# Altium schematic sheet M1 Design.SchDoc
size A3; SheetNumber: 1; SheetTotal: 1
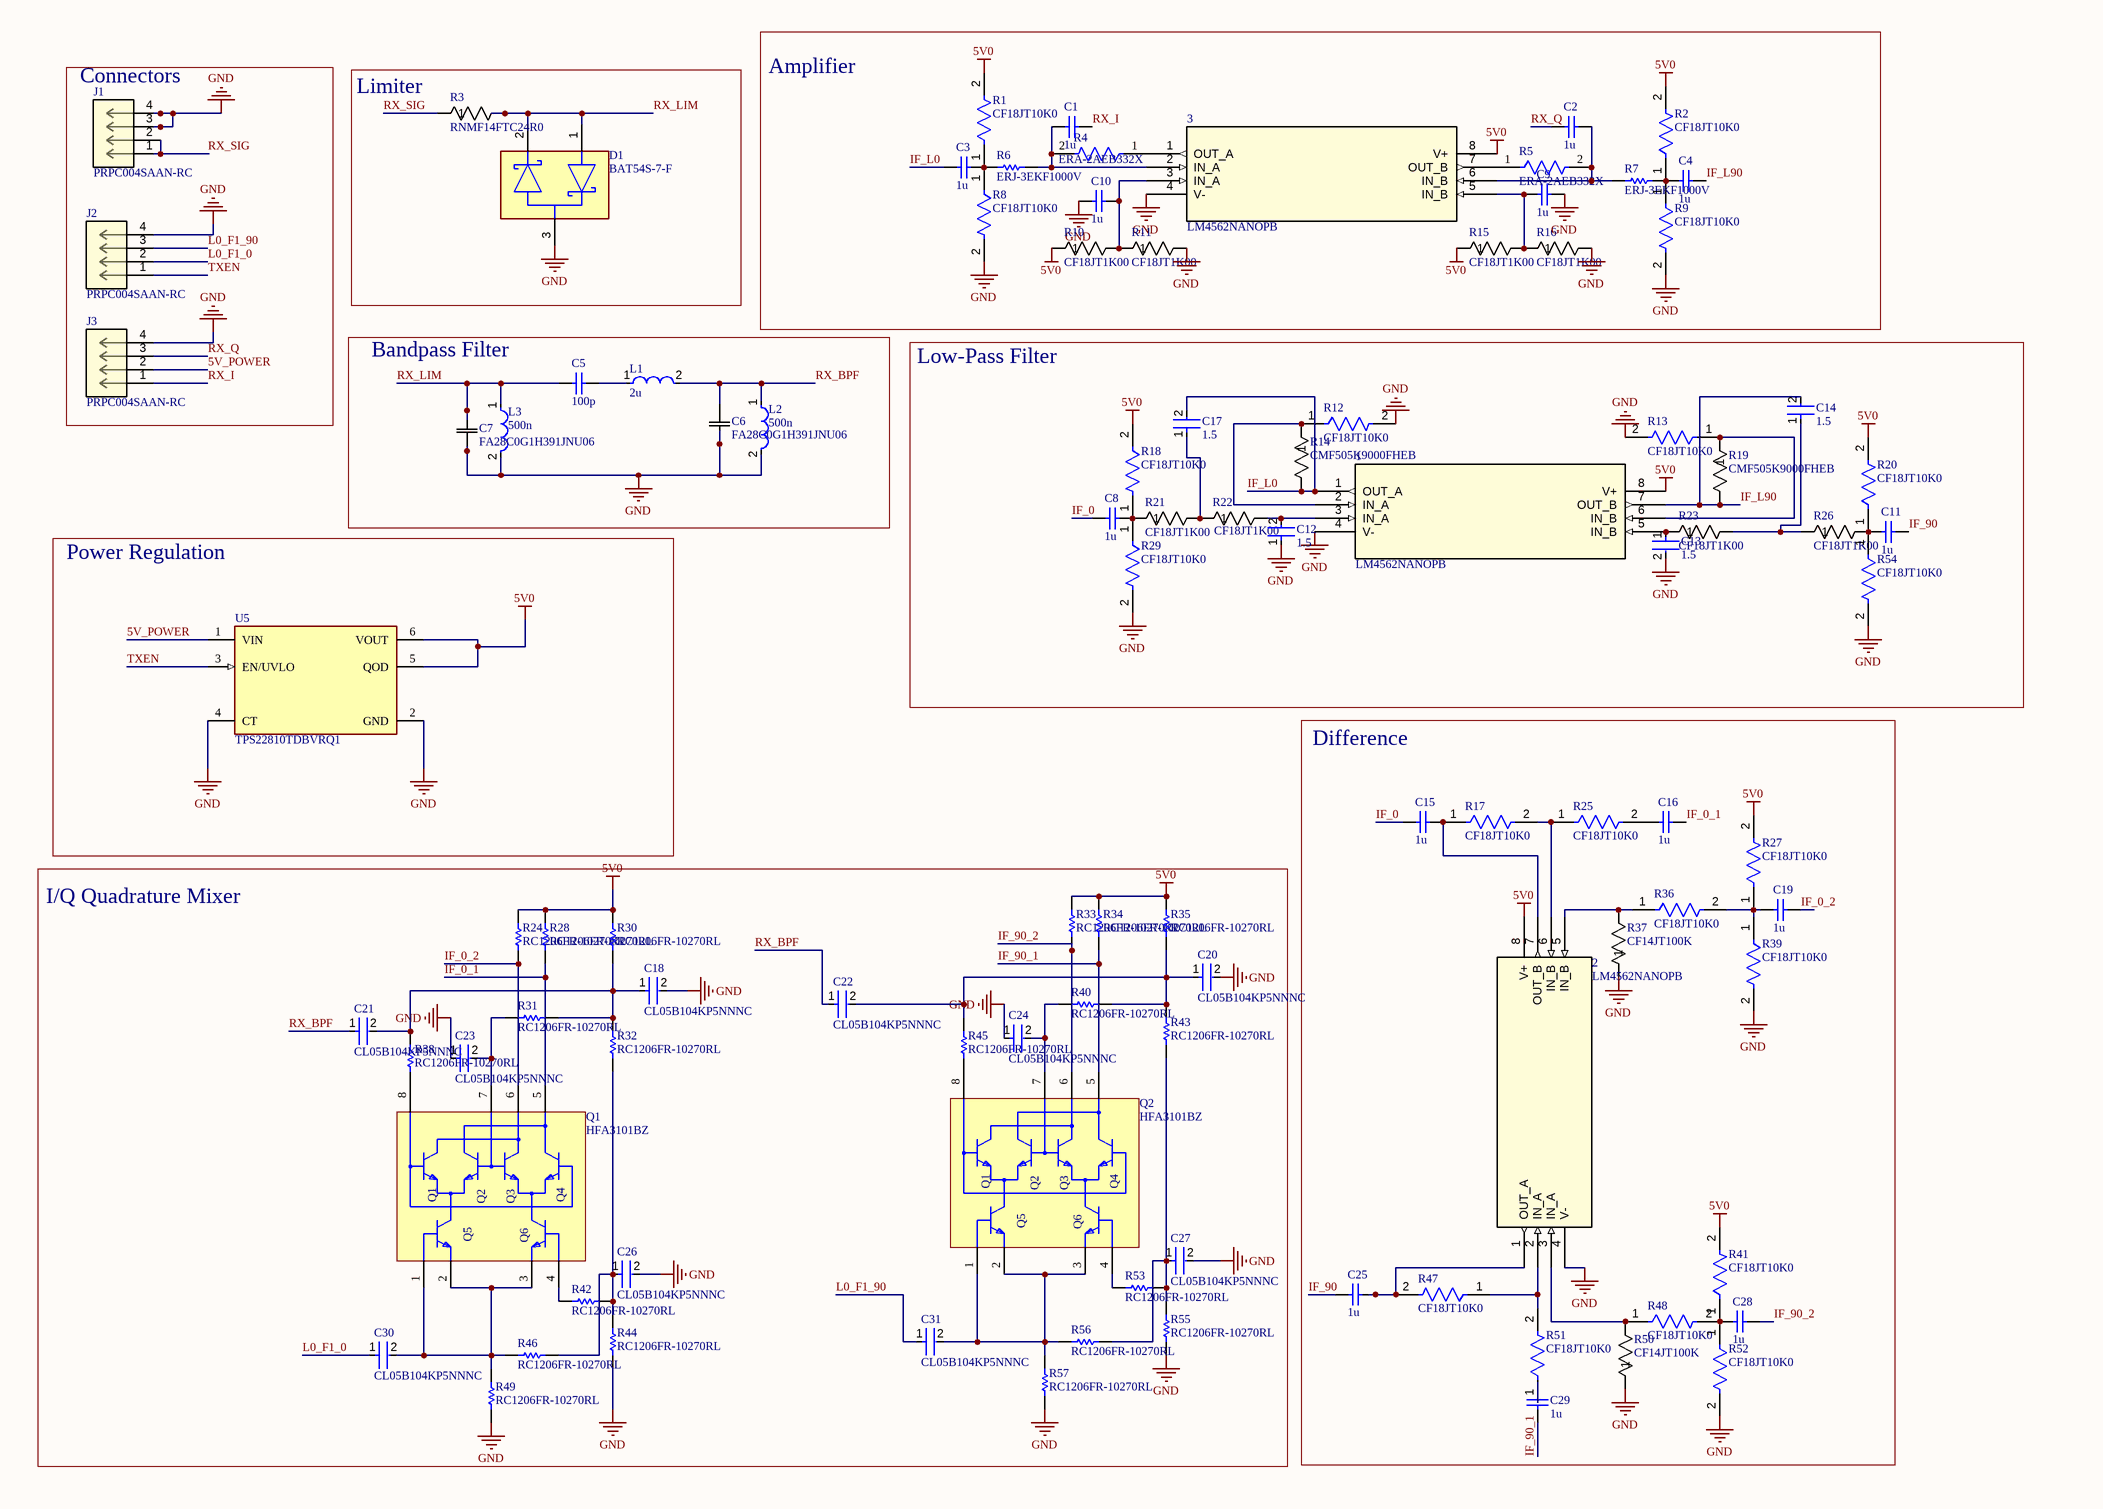
[diagram p0: M1 Design.SchDoc]

## Parts
1  LM4562NANOPB  [N08E]
2  LM4562NANOPB  [N08E]
3  LM4562NANOPB  [N08E]
C1  1u  [CAPC3216X110X50LL20T25]
C2  1u  [CAPC3216X110X50LL20T25]
C3  1u  [CAPC3216X110X50LL20T25]
C4  1u  [CAPC3216X110X50LL20T25]
C5  100p  [CAPC1608X90X40ML10T20]
C6  FA28C0G1H391JNU06  [CAP_FA28_TDK]
C7  FA28C0G1H391JNU06  [CAP_FA28_TDK]
C8  1u  [CAPC3216X110X50LL20T25]
C9  1u  [CAPC3216X110X50LL20T25]
C10  1u  [CAPC3216X110X50LL20T25]
C11  1u  [CAPC3216X110X50LL20T25]
C12  1.5  [FP-C0402-BB-MFG]
C13  1.5  [FP-C0402-BB-MFG]
C14  1.5  [FP-C0402-BB-MFG]
C15  1u  [CAPC3216X110X50LL20T25]
C16  1u  [CAPC3216X110X50LL20T25]
C17  1.5  [FP-C0402-BB-MFG]
C18  CL05B104KP5NNNC  [FP-CL17-IPC_C]
C19  1u  [CAPC3216X110X50LL20T25]
C20  CL05B104KP5NNNC  [FP-CL17-IPC_C]
C21  CL05B104KP5NNNC  [FP-CL17-IPC_C]
C22  CL05B104KP5NNNC  [FP-CL17-IPC_C]
C23  CL05B104KP5NNNC  [FP-CL17-IPC_C]
C24  CL05B104KP5NNNC  [FP-CL17-IPC_C]
C25  1u  [CAPC3216X110X50LL20T25]
C26  CL05B104KP5NNNC  [FP-CL17-IPC_C]
C27  CL05B104KP5NNNC  [FP-CL17-IPC_C]
C28  1u  [CAPC3216X110X50LL20T25]
C29  1u  [CAPC3216X110X50LL20T25]
C30  CL05B104KP5NNNC  [FP-CL17-IPC_C]
C31  CL05B104KP5NNNC  [FP-CL17-IPC_C]
D1  BAT54S-7-F  [FP-SOT23-MFG]
J1  PRPC004SAAN-RC  [CONN4_PRPC004_SUL]
J2  PRPC004SAAN-RC  [CONN4_PRPC004_SUL]
J3  PRPC004SAAN-RC  [CONN4_PRPC004_SUL]
L1  2u  [FP-LQW15CA_00-MFG]
L2  500n  [FP-LQW15CA_00-MFG]
L3  500n  [FP-LQW15CA_00-MFG]
Q1  HFA3101BZ  [M8_15_MFG]
Q2  HFA3101BZ  [M8_15_MFG]
R1  CF18JT10K0  [FP-CF18-MFG]
R2  CF18JT10K0  [FP-CF18-MFG]
R3  RNMF14FTC24R0  [STA_RNMF14_STP]
R4  ERA-2AEB332X  [FP-ERA2A-MFG]
R5  ERA-2AEB332X  [FP-ERA2A-MFG]
R6  ERJ-3EKF1000V  [RESC1608X55X30LL15T15]
R7  ERJ-3EKF1000V  [RESC1608X55X30LL15T15]
R8  CF18JT10K0  [FP-CF18-MFG]
R9  CF18JT10K0  [FP-CF18-MFG]
R10  CF18JT1K00  [STA_CF18_STP]
R11  CF18JT1K00  [STA_CF18_STP]
R12  CF18JT10K0  [FP-CF18-MFG]
R13  CF18JT10K0  [FP-CF18-MFG]
R14  CMF505K9000FHEB  [RES_CMF50_VIS]
R15  CF18JT1K00  [STA_CF18_STP]
R16  CF18JT1K00  [STA_CF18_STP]
R17  CF18JT10K0  [FP-CF18-MFG]
R18  CF18JT10K0  [FP-CF18-MFG]
R19  CMF505K9000FHEB  [RES_CMF50_VIS]
R20  CF18JT10K0  [FP-CF18-MFG]
R21  CF18JT1K00  [STA_CF18_STP]
R22  CF18JT1K00  [STA_CF18_STP]
R23  CF18JT1K00  [STA_CF18_STP]
R24  RC1206FR-10270RL  [RESC3116X65X40NL10T20]
R25  CF18JT10K0  [FP-CF18-MFG]
R26  CF18JT1K00  [STA_CF18_STP]
R27  CF18JT10K0  [FP-CF18-MFG]
R28  RC1206FR-10270RL  [RESC3116X65X40NL10T20]
R29  CF18JT10K0  [FP-CF18-MFG]
R30  RC1206FR-10270RL  [RESC3116X65X40NL10T20]
R31  RC1206FR-10270RL  [RESC3116X65X40NL10T20]
R32  RC1206FR-10270RL  [RESC3116X65X40NL10T20]
R33  RC1206FR-10270RL  [RESC3116X65X40NL10T20]
R34  RC1206FR-10270RL  [RESC3116X65X40NL10T20]
R35  RC1206FR-10270RL  [RESC3116X65X40NL10T20]
R36  CF18JT10K0  [FP-CF18-MFG]
R37  CF14JT100K  [STA_CF14_STP]
R38  RC1206FR-10270RL  [RESC3116X65X40NL10T20]
R39  CF18JT10K0  [FP-CF18-MFG]
R40  RC1206FR-10270RL  [RESC3116X65X40NL10T20]
R41  CF18JT10K0  [FP-CF18-MFG]
R42  RC1206FR-10270RL  [RESC3116X65X40NL10T20]
R43  RC1206FR-10270RL  [RESC3116X65X40NL10T20]
R44  RC1206FR-10270RL  [RESC3116X65X40NL10T20]
R45  RC1206FR-10270RL  [RESC3116X65X40NL10T20]
R46  RC1206FR-10270RL  [RESC3116X65X40NL10T20]
R47  CF18JT10K0  [FP-CF18-MFG]
R48  CF18JT10K0  [FP-CF18-MFG]
R49  RC1206FR-10270RL  [RESC3116X65X40NL10T20]
R50  CF14JT100K  [STA_CF14_STP]
R51  CF18JT10K0  [FP-CF18-MFG]
R52  CF18JT10K0  [FP-CF18-MFG]
R53  RC1206FR-10270RL  [RESC3116X65X40NL10T20]
R54  CF18JT10K0  [FP-CF18-MFG]
R55  RC1206FR-10270RL  [RESC3116X65X40NL10T20]
R56  RC1206FR-10270RL  [RESC3116X65X40NL10T20]
R57  RC1206FR-10270RL  [RESC3116X65X40NL10T20]
U5  TPS22810TDBVRQ1  [FP-DBV0006A-MFG]

## Blocks framed on the sheet
Connectors: J1-J3
Limiter: D1 R3
Amplifier: 3 C1-C4 C9 C10 R1 R2 R4-R11 R15 R16
Bandpass Filter: C5-C7 L1-L3
Low-Pass Filter: 1 C8 C11-C14 C17 R12-R14 R18-R23 R26 R29 R54
Power Regulation: U5
Difference: 2 C15 C16 C19 C25 C28 C29 R17 R25 R27 R36 R37 R39 R41 R47 R48 R50-R52
I/Q Quadrature Mixer: C18 C20-C24 C26 C27 C30 C31 Q1 Q2 R24 R28 R30-R35 R38 R40 R42-R46 R49 R53 R55-R57

## Nets
5V0: 1.8(V+) 2.8(V+) 3.8(V+) R1.2 R2.2 R10.1 R15.1 R18.2 R20.2 R24.2 R27.2 R28.2 R30.2 R33.2 R34.2 R35.2 R41.2 U5.5(QOD) U5.6(VOUT)
GND: 1.4(V-) 2.4(V-) 3.4(V-) C6.1 C7.1 C9.2 C10.1 C12.1 C13.2 C18.2 C20.2 C23.1 C24.1 C26.2 C27.2 D1.3 J1.3 J1.4 J2.4 J3.4 L2.2 L3.2 R8.2 R9.2 R11.2 R12.2 R13.2 R16.2 R29.2 R37.1 R39.2 R44.1 R49.1 R50.1 R52.2 R54.2 R55.1 R57.1 U5.2(GND) U5.4(CT)
5V_POWER: J3.2 U5.1(VIN)
IF_0: C8.1 C15.1
IF_0_1: C16.2 Q1.5(C2_C4) R28.1
IF_0_2: C19.2 Q1.6(C1_C3) R24.1
IF_90: C11.2 C25.1
IF_90_1: C29.2 Q2.5(C2_C4) R34.1
IF_90_2: C28.2 Q2.6(C1_C3) R33.1
IF_L0: 1.1(OUT_A) C3.1 C17.2 R14.2
IF_L90: 1.7(OUT_B) C4.2 C14.2 R19.2
L0_F1_0: C30.1 J2.2
L0_F1_90: C31.1 J2.3
RX_BPF: C6.2 C21.1 C22.1 L1.2 L2.1
RX_I: C1.2 J3.1
RX_LIM: C5.1 C7.2 D1.1 D1.2 L3.1 R3.2
RX_Q: C2.1 J3.3
RX_SIG: J1.1 J1.2 R3.1
TXEN: J2.1 U5.3(EN/UVLO)
Net1_2: 1.2(IN_A) R12.1 R14.1
Net1_3: 1.3(IN_A) C12.2 R22.2
Net1_5: 1.5(IN_B) C13.1 R23.1
Net1_6: 1.6(IN_B) R13.1 R19.1
Net2_1: 2.1(OUT_A) C25.2 R47.2
Net2_2: 2.2(IN_A) R47.1 R51.2
Net2_3: 2.3(IN_A) R48.1 R50.2
Net2_5: 2.5(IN_B) R36.1 R37.2
Net2_6: 2.6(IN_B) R17.2 R25.1
Net2_7: 2.7(OUT_B) C15.2 R17.1
Net3_1: 3.1(OUT_A) R4.1
Net3_2: 3.2(IN_A) C1.1 R4.2 R6.2
Net3_3: 3.3(IN_A) C10.2 R10.2 R11.1
Net3_5: 3.5(IN_B) C9.1 R15.2 R16.1
Net3_6: 3.6(IN_B) C2.2 R5.2 R7.1
Net3_7: 3.7(OUT_B) R5.1
NetC3_2: C3.2 R1.1 R6.1 R8.1
NetC4_1: C4.1 R2.1 R7.2 R9.1
NetC5_2: C5.2 L1.1
NetC8_2: C8.2 R18.1 R21.1 R29.1
NetC11_1: C11.1 R20.1 R26.2 R54.1
NetC14_1: C14.1 R23.2 R26.1
NetC16_1: C16.1 R25.2
NetC17_1: C17.1 R21.2 R22.1
NetC18_1: C18.1 C21.2 R30.1 R31.1 R32.2 R38.2
NetC19_1: C19.1 R27.1 R36.2 R39.1
NetC20_1: C20.1 C22.2 R35.1 R40.1 R43.2 R45.2
NetC23_2: C23.2 Q1.7(B2_B3) R31.2
NetC24_2: C24.2 Q2.7(B2_B3) R40.2
NetC26_1: C26.1 R32.1 R42.1 R44.2 R46.1
NetC27_1: C27.1 R43.1 R53.1 R55.2 R56.1
NetC28_1: C28.1 R41.1 R48.2 R52.1
NetC29_1: C29.1 R51.1
NetC30_2: C30.2 Q1.1(B5) Q1.2(E5) Q1.3(E6) R46.2 R49.2
NetC31_2: C31.2 Q2.1(B5) Q2.2(E5) Q2.3(E6) R56.2 R57.2
NetQ1_4: Q1.4(B6) R42.2
NetQ1_8: Q1.8(B1_B4) R38.1
NetQ2_4: Q2.4(B6) R53.2
NetQ2_8: Q2.8(B1_B4) R45.1

## Notes on the sheet
- DWG. NO.
- REV.
- SHT.
- THIS DOCUMENT AND THE DATA DISCLOSED HEREIN OR HEREWITH IS THE PROPERTY OF ALTIUM LIMITED AND MAY BE FREELY DISTRIBUTED IN WHOLE. NO RIGHTS ARE RESERVED OR EXPRESS OR IMPLIED WARANTEE GIVEN.
- REVISION
- DESCRIPTION
- DATE
- APPROVED
- ENG:
- APPROVALS
- PROJECT
- DSN:
- CHK:
- REFERENCE DOCUMENTS
- PROJECT REVISION:
- TITLE
- DOCUMENT REVISION:
- DESIGN ITEM:
- BOM:
- FAB DWG:
- PCB DWG:
- ASSY DWG:
- SCALE:
- SIZE
- B
- CAGE CODE
- FILE NAME
- DWG NO.
- SHEET
- OF
- REV
- (in symbol CMP-00572-88252381-1) Q1; Q4; Q3; Q5; Q6; Q2

## Library data of the parts
1-3 = LM4562NANOPB: No Description Available; Mfr_Name: Texas Instruments; RefDes: RefDes; Type: Type
C1-C4 C8-C11 C15 C16 C19 C25 C28 C29 = CMP-2000-06011-1: Chip Capacitor, 1 uF, +/- 10%, 50 V, -55 to 125 degC, 1206 (3216 Metric), RoHS, Tape and Reel; Manufacturer: Kemet; Case Height: 1mm; Dielectric: X7R; Voltage Rating: 50V; Capacitance: 1uF; Temperature Coefficient / Code: +/-15%; Case Length: 3.2mm; Case Width: 1.6mm; Type: SMDMLCCX7R6.3-250VDCCommericalGrade; Class: Class1; Capacitance - nF: 1000nF; Datasheet URL: http://www.kemet.com/docfinder?Partnumber=C1206C105K5RACTU; Product Category: MultilayerCeramicCapacitorsMLCC-SMD/SMT; Termination Style: SMD/SMT; Dimensions: 1.6mmWx3.2mmLx1mmH; Voltage Rating DC: 50V; Datasheet Version: 02/2016; Packaging: Reel; Brand: Kemet; RoHS: Details; Minimum Operating Temperature: -55C; Operating Temperature Range: -55Cto+125C; Package Reference: 1206; Manufacturer URL: http://www.kemet.com/; Product: GeneralTypeMLCCs; Tolerance: 10%; Package Description: 2-Pin Surface Mount Device, Body 3.2 x 1.6 mm; Mounting Technology: SurfaceMount; Case Code - mm: 3216; Maximum Operating Temperature: +125C; Series: C1206C; Factory Pack Quantity: 2500; Package / Case: 1206(3216metric); Case Code - in: 1206
C5 = CMP-2100-03594-1: Chip Capacitor, 100 pF, +/- 5%, 50 V, -55 to 125 degC, 0603 (1608 Metric), RoHS, Tape and Reel; Manufacturer: Yageo; Capacitance: 100pF; Voltage Rating (DC): 50V; Dielectric: C0G; Temperature Coefficient: 30ppm/degC; Insulation Resistance: 100GR; Datasheet Version: Rev. 14, 07/2016; Manufacturer URL: http://www.yageo.com/; Packaging: TapeandReel; Mount: SurfaceMount; RoHSCompliant: True; Package Reference: 0603; Tolerance: 5%; Max Operating Temperature: 125degC; Case Code (Imperial): 0603; Number of Pins: 2; Width: 0.8mm; Case Code (Metric): 1608; Voltage: 50V; REACH SVHC: Unknown; Package Description: 2-Pin Surface Mount Device, Body 1.6 x 0.8 mm; Composition: Ceramic; Lead Free: LeadFree; Min Operating Temperature: -55degC; Radiation Hardening: No; Depth: 0.8mm; Thickness: 0.035inch; Datasheet URL: http://www.yageo.com/documents/recent/UPY-GP_NP0_16V-to-50V_14.pdf; Termination: SMD/SMT; Package Quantity: 1; Length: 1.6mm; Voltage Rating: 50V; Height: 0.8mm; Case/Package: 0603
C6 C7 = FA28C0G1H391JNU06: No Description Available; Mfr_Name: TDK
C12-C14 C17 = CMP-2008-03106-2: CAP CER 1500PF 50V NP0 0402; Manufacturer Part Number: C0402C152J5GACTU; Manufacturer: Kemet; Capacitance: 1,500 pF; Value: 1,500 pF; Temperature Coefficient: 15%; Temperature Characteristic: C0G; Material: Ceramic; Tolerance: 0.05; Device Class L3: Ceramic Capacitors; Device Class L1: Passive Components; Octopart: https://octopart.com/c0402c152j5gactu-kemet-12793166; RoHS: TRUE; Digikey Description: CAP CER 1500PF 50V NP0 0402; Ipc Land Pattern Name: CAPC10050X50; Automotive: No; Package: C0402-BB; Temperature Range High: +125°C; Height: 0.55mm; Temperature: -55°C to +125°C; Device Class L2: Capacitors; Mouser Description: Multilayer Ceramic Capacitors MLCC - SMD/SMT 50V 0.0015uF 5% C0G; ComponentLink2Description: Datasheet; Lead Free: Yes; ComponentLink2URL: https://content.kemet.com/datasheets/KEM_C1002_X7R_SMD.pdf; Category: Cap; Voltage Rating: 50 V; Temperature Range Low: -55°C
C18 C20-C24 C26 C27 C30 C31 = CMP-13271-001069-1: Cap Ceramic 100nF 10V X7R ±10% SMD 0402 +125°C Paper T/R; Height: 0.5mm; Case/Package: 0402; Contact Plating: Tin; Case Code (Imperial): 0402; Capacitance: 100nF; Thickness: 0.022inch; Min Operating Temperature: -55°C; Package Quantity: 1; Length: 1mm; Max Operating Temperature: 125°C; Depth: 0.5mm; Voltage Rating: 10V; Packaging: Tape and Reel; Mount: Surface Mount; Tolerance: 10%; Width: 0.02inch; Radiation Hardening: No; Case Code (Metric): 1005; Dielectric: X7R
D1 = CMP-1667-00006-2: DIODE ARRAY SCHOTTKY 30V SOT23-3; Forward Voltage: 800mV; Reverse Recovery Time: 5ns; Peak Non-Repetitive Surge Current: 600mA; Power Rating: 200mW; Current Rating: 200mA; Peak Reverse Current: 2uA; Capacitance: 10pF; Width: 1.3mm; Mount: Surface Mount; Height: 1mm; Number of Pins: 3; Weight: 0.000282oz; Max Reverse Voltage (DC): 30V; Max Power Dissipation: 200mW; Lead Free: Lead Free; Max Operating Temperature: 150°C; Min Operating Temperature: -65°C; Package Quantity: 3000; REACH SVHC: No SVHC; Termination: SMD/SMT; Max Forward Surge Current (Ifsm): 600mA; Radiation Hardening: No; Voltage Rating (DC): 30V; Average Rectified Current: 200mA; Max Repetitive Reverse Voltage (Vrrm): 30V; Contact Plating: Tin; Case/Package: SOT-23; Forward Current: 200mA; Power Dissipation: 200mW; Length: 2.9mm; Packaging: Tape and Reel
J1-J3 = PRPC004SAAN-RC: No Description Available; Mfr_Name: Sullins; Type: Headers, Male Pins; RefDes: RefDes
L1 = CMP-06042-013572-1: Wire Wound Ferrite Inductor for General Circuits 2000nH ±10% 130mA 3.2Ω 0402 (1005); Inductance: 2uH; DC Resistance (DCR): 3.2R; Shielding: Unshielded; Self Resonant Frequency: 120MHz; Test Frequency: 10MHz; Current Rating: 130mA; Mount: Surface Mount; Width: 0.022inch; Max Operating Temperature: 125°C; Length: 0.04inch; Case/Package: Nonstandard; Height - Seated (Max): 0.026inch; Resistor Type: Wirewound; Core Material: Ferrite; Tolerance: 10%; Packaging: Tape and Reel; Min Operating Temperature: -40°C
L2 L3 = CMP-06042-006025-1: Wire Wound Ferrite Inductor for General Circuits 500nH ±5% 270mA 0.97Ω 0402 (1005); Self Resonant Frequency: 900MHz; DC Resistance (DCR): 970mR; Test Frequency: 10MHz; Shielding: Unshielded; Mount: Surface Mount; Tolerance: 5%; Length: 0.04inch; Inductance: 500nH; Core Material: Ferrite; Packaging: Cut Tape; Max Operating Temperature: 125°C; Height - Seated (Max): 0.026inch; Current Rating: 270mA; Width: 0.022inch; Case/Package: Nonstandard; Min Operating Temperature: -40°C; Resistor Type: Wirewound
Q1 Q2 = CMP-00572-88252381-1: HFA3096 Series NPN 12 Vce 10 Ghz UHF Transistor Array - SOIC-8; Manufacturer Lifecycle Status: ACTIVE; Transition Frequency: 10GHz; Collector Emitter Voltage (VCEO): 8V; Noise Figure: 3.5dB; Collector Base Voltage (VCBO): 12V; Current Rating: 30mA; Emitter Base Voltage (VEBO): 5.5V; Pitch: 1.3mm; Bandwidth: 900MHz; Gain Bandwidth Product: 10GHz; ComponentLink3Description: Manufacturer's Package Drawing; Schedule B: 8542330000; Collector Emitter Breakdown Voltage: 8V; RoHS: Compliant; Lead Free: Lead Free; ComponentLink1URL: http://www.renesas.com; Lifecycle Status: Production; Voltage Rating (DC): 8V; Contact Plating: Tin; Packaging: Bulk; ComponentLink2URL: https://octopart.com/cad-content/api/get-model-datasheet/15189/88252381; ComponentLink3URL: https://www.renesas.com/en/document/psc/m815-8-lead-narrow-body-small-outline-plastic-package; ComponentLink2Description: Datasheet URL; Max Frequency: 10GHz; Max Operating Temperature: 85°C; HelpURL: https://octopart.com/cad-content/api/get-model-datasheet/15189/88252381; Min Operating Temperature: -40°C; Height: 0m; Radiation Hardening: No; Continuous Collector Current: 30mA; Polarity: NPN; Mount: Surface Mount; Case/Package: SOIC; Number of Pins: 8; Max Collector Current: 30mA; Length: 4.9mm; REACH SVHC: No SVHC; ComponentLink1Description: Manufacturer's Website; Width: 3.9mm
R1 R2 R8 R9 R12 R13 R17 R18 R20 R25 R27 R29 R36 R39 R41 R47 R48 R51 R52 R54 = CMP-26528-000002-1: RES 10K OHM 1/8W 5% CF AXIAL; Manufacturer: Stackpole Electronics; Power Rating: 0.125W; Temperature Coefficient: 0-500ppm/°C; Resistance: 10kΩ; Voltage Rating: 250V; Value: 10kΩ; Temperature: -55°C to +155°C; Height: 2mm; Lead Free: Yes; Automotive: No; Device Class L2: Resistors; Package: CF18; Series: CF; ComponentLink2Description: Datasheet; Ipc Land Pattern Name: RESAD656W65L360D200; Manufacturer Part Number: CF18JT10K0; Temperature Range High: +155°C; RoHS: TRUE; Device Class L3: Through-Hole Resistors; Temperature Range Low: -55°C; Device Class L1: Passive Components; Category: Res; Octopart: https://octopart.com/cf18jt10k0-stackpole+electronics-19205642; Composition: Carbon Film; Digikey Description: RES 10K OHM 1/8W 5% CF AXIAL; ComponentLink2URL: http://www.seielect.com/Catalog/SEI-CF_CFM.pdf; Tolerance: 5%
R3 = RNMF14FTC24R0: No Description Available; Mfr_Name: Stackpole International
R4 R5 = CMP-2002-05884-2: NexarPartId: 9251384; Voltage Rating (DC): 25V; Temperature Coefficient: 25ppm/°C; Tolerance: 0.1%; Resistance: 3.3kΩ; Power Rating: 63mW; Case/Package: 0402; Number of Terminations: 2; Military Standard: Not; Case Code (Imperial): 0402; Length: 1mm; Contact Plating: Tin; Termination: SMD/SMT; Schedule B: 8533210045, 8533210045; Voltage Rating: 25V; Lead Free: Lead Free; Min Operating Temperature: -55°C; REACH SVHC: No SVHC; Max Power Dissipation: 63mW; Weight: 793.786648µg; RoHS: Compliant; Depth: 500µm; Packaging: Cut Tape; Max Operating Temperature: 155°C; Width: 500µm; Case Code (Metric): 1005; Height: 350µm; Composition: Thin Film; Lifecycle Status: Production; Radiation Hardening: No; Number of Pins: 2; Mount: Surface Mount
R6 R7 = CMP-2000-00179-1: Manufacturer: Panasonic; Part Number: ERJ-3EKF1000V
R10 R11 R15 R16 R21-R23 R26 = CF18JT1K00: No Description Available; Mfr_Name: Stackpole International
R14 R19 = CMF505K9000FHEB: No Description Available; Mfr_Name: Vishay
R24 R28 R30-R35 R38 R40 R42-R46 R49 R53 R55-R57 = CMP-2003-03521-1: Manufacturer: Yageo; Part Number: RC1206FR-10270RL
R37 R50 = CF14JT100K: No Description Available; Mfr_Name: Stackpole International
U5 = CMP-04910-000007-2: IC PWR SWITCH N-CHAN 1:1 SOT23-6; Max Output Current: 2A; Max Supply Voltage: 18V; Min Supply Voltage: 2.7V; Number of Outputs: 1; Output Configuration: High Side; Fault Protection: Over Temperature; Interface: On/Off; Weight: 0.000801oz; Case/Package: SOT-23-6; Series: TPS22810-Q1; Package Quantity: 3000; RoHS Compliant: Yes; Number of Channels: 1; Max Operating Temperature: 105°C; Packaging: Cut Tape; Min Operating Temperature: -40°C